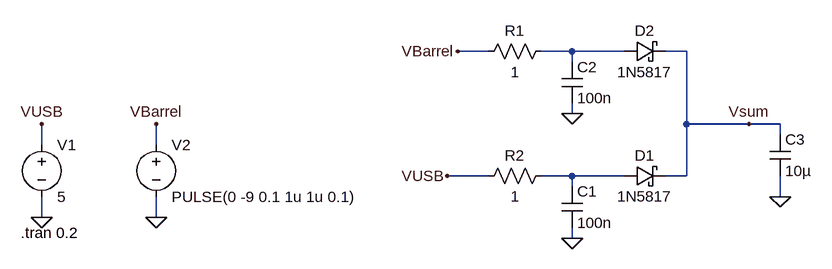
[diagram p0: schematic powerup.asc]
powerup.asc, the LTspice schematic file:
Version 4
SHEET 1 1160 680
WIRE 656 -32 608 -32
WIRE 784 -32 736 -32
WIRE 864 -32 784 -32
WIRE 960 -32 928 -32
WIRE 784 -16 784 -32
WIRE 784 64 784 48
WIRE 960 80 960 -32
WIRE 1056 80 960 80
WIRE 1104 80 1056 80
WIRE 1104 96 1104 80
WIRE -32 112 -32 80
WIRE 144 112 144 80
WIRE 656 160 592 160
WIRE 784 160 736 160
WIRE 864 160 784 160
WIRE 960 160 960 80
WIRE 960 160 928 160
WIRE 784 176 784 160
WIRE 1104 192 1104 160
WIRE -32 224 -32 192
WIRE 144 224 144 192
WIRE 784 256 784 240
FLAG -32 224 0
FLAG 144 224 0
FLAG -32 80 VUSB
FLAG 144 80 VBarrel
FLAG 592 160 VUSB
FLAG 784 256 0
FLAG 784 64 0
FLAG 608 -32 VBarrel
FLAG 1104 192 0
FLAG 1056 80 Vsum
SYMBOL voltage -32 96 R0
WINDOW 123 0 0 Left 0
WINDOW 39 0 0 Left 0
SYMATTR InstName V1
SYMATTR Value 5
SYMBOL voltage 144 96 R0
WINDOW 123 0 0 Left 0
WINDOW 39 0 0 Left 0
SYMATTR InstName V2
SYMATTR Value PULSE(0 -9 0.1 1u 1u 0.1)
SYMBOL cap 768 176 R0
SYMATTR InstName C1
SYMATTR Value 100n
SYMBOL schottky 864 176 R270
WINDOW 0 32 32 VTop 2
WINDOW 3 0 32 VBottom 2
SYMATTR InstName D1
SYMATTR Value 1N5817
SYMATTR Description Diode
SYMATTR Type diode
SYMBOL cap 768 -16 R0
SYMATTR InstName C2
SYMATTR Value 100n
SYMBOL schottky 864 -16 R270
WINDOW 0 32 32 VTop 2
WINDOW 3 0 32 VBottom 2
SYMATTR InstName D2
SYMATTR Value 1N5817
SYMATTR Description Diode
SYMATTR Type diode
SYMBOL cap 1088 96 R0
SYMATTR InstName C3
SYMATTR Value 10µ
SYMBOL res 752 -48 R90
WINDOW 0 0 56 VBottom 2
WINDOW 3 32 56 VTop 2
SYMATTR InstName R1
SYMATTR Value 1
SYMBOL res 752 144 R90
WINDOW 0 0 56 VBottom 2
WINDOW 3 32 56 VTop 2
SYMATTR InstName R2
SYMATTR Value 1
TEXT -64 248 Left 2 !.tran 0.2

The netlist it stands for:
* powerup.asc
V1 VUSB 0 5
V2 VBarrel 0 PULSE(0 -9 0.1 1u 1u 0.1)
C1 N002 0 100n
D1 N002 Vsum 1N5817
C2 N001 0 100n
D2 N001 Vsum 1N5817
C3 Vsum 0 10µ
R1 N001 VBarrel 1
R2 N002 VUSB 1
.model D D
.lib standard.dio
.tran 0.2
.backanno
.end